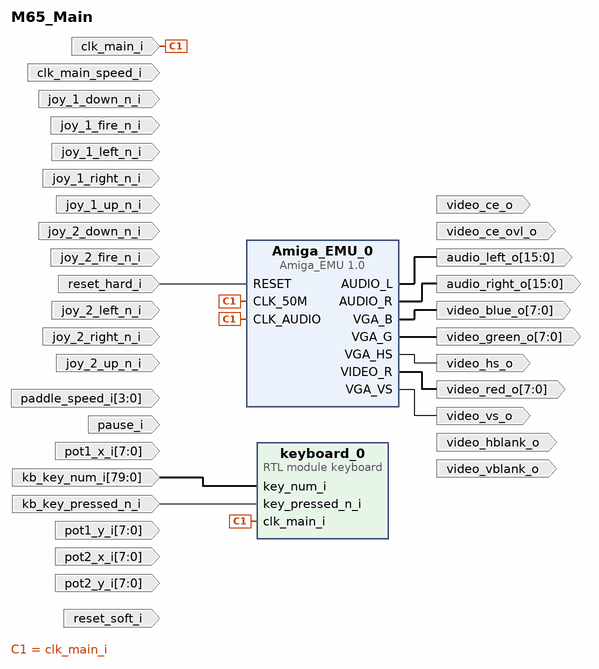
[diagram p0: block diagram of the top level]
# Vivado block design M65_Main, xc7a200tfbg484-3, Vivado 2024.2.1
create_bd_design M65_Main

create_bd_port -dir I -type clk clk_main_i
set_property -dict {CONFIG.FREQ_HZ 50000000} [get_bd_ports clk_main_i]
create_bd_port -dir I -type rst reset_soft_i
set_property -dict {CONFIG.POLARITY ACTIVE_HIGH} [get_bd_ports reset_soft_i]
create_bd_port -dir I -type rst reset_hard_i
set_property -dict {CONFIG.POLARITY ACTIVE_HIGH} [get_bd_ports reset_hard_i]
create_bd_port -dir I pause_i
create_bd_port -dir I -type clk clk_main_speed_i
set_property -dict {CONFIG.FREQ_HZ 50000000} [get_bd_ports clk_main_speed_i]
create_bd_port -dir O video_ce_o
create_bd_port -dir O video_ce_ovl_o
create_bd_port -dir O -from 7 -to 0 video_red_o
create_bd_port -dir O -from 7 -to 0 video_green_o
create_bd_port -dir O -from 7 -to 0 video_blue_o
create_bd_port -dir O video_vs_o
create_bd_port -dir O video_hs_o
create_bd_port -dir O video_hblank_o
create_bd_port -dir O video_vblank_o
create_bd_port -dir O -from 15 -to 0 audio_left_o
create_bd_port -dir O -from 15 -to 0 audio_right_o
create_bd_port -dir I kb_key_pressed_n_i
create_bd_port -dir I joy_1_up_n_i
create_bd_port -dir I joy_1_down_n_i
create_bd_port -dir I joy_1_left_n_i
create_bd_port -dir I joy_1_right_n_i
create_bd_port -dir I joy_1_fire_n_i
create_bd_port -dir I joy_2_up_n_i
create_bd_port -dir I joy_2_down_n_i
create_bd_port -dir I joy_2_left_n_i
create_bd_port -dir I joy_2_right_n_i
create_bd_port -dir I joy_2_fire_n_i
create_bd_port -dir I -from 7 -to 0 pot1_x_i
create_bd_port -dir I -from 7 -to 0 pot1_y_i
create_bd_port -dir I -from 7 -to 0 pot2_x_i
create_bd_port -dir I -from 7 -to 0 pot2_y_i
create_bd_port -dir I -from 3 -to 0 paddle_speed_i
create_bd_port -dir I -from 79 -to 0 kb_key_num_i

create_bd_cell -type module -reference keyboard keyboard_0
create_bd_cell -type ip -vlnv xilinx.com:user:Amiga_EMU:1.0 Amiga_EMU_0

# ---- connections ----

connect_bd_net [get_bd_pins Amiga_EMU_0/AUDIO_L] [get_bd_ports audio_left_o]
connect_bd_net [get_bd_pins Amiga_EMU_0/AUDIO_R] [get_bd_ports audio_right_o]
connect_bd_net [get_bd_pins Amiga_EMU_0/VGA_B] [get_bd_ports video_blue_o]
connect_bd_net [get_bd_pins Amiga_EMU_0/VGA_G] [get_bd_ports video_green_o]
connect_bd_net [get_bd_pins Amiga_EMU_0/VGA_HS] [get_bd_ports video_hs_o]
connect_bd_net [get_bd_pins Amiga_EMU_0/VGA_VS] [get_bd_ports video_vs_o]
connect_bd_net [get_bd_pins Amiga_EMU_0/VIDEO_R] [get_bd_ports video_red_o]
connect_bd_net [get_bd_ports clk_main_i] [get_bd_pins keyboard_0/clk_main_i] [get_bd_pins Amiga_EMU_0/CLK_AUDIO] [get_bd_pins Amiga_EMU_0/CLK_50M]
connect_bd_net [get_bd_ports kb_key_num_i] [get_bd_pins keyboard_0/key_num_i]
connect_bd_net [get_bd_ports kb_key_pressed_n_i] [get_bd_pins keyboard_0/key_pressed_n_i]
connect_bd_net [get_bd_ports reset_hard_i] [get_bd_pins Amiga_EMU_0/RESET]

validate_bd_design
save_bd_design
